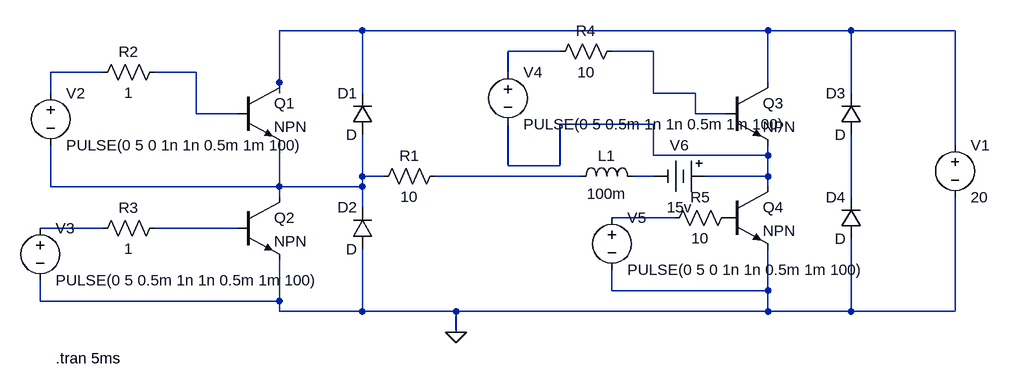
[diagram p0: schematic FullWaveInverter_RLE.asc]
FullWaveInverter_RLE.asc, the LTspice schematic file:
Version 4
SHEET 1 1180 680
WIRE 208 48 80 48
WIRE 832 48 208 48
WIRE 960 48 832 48
WIRE 1120 48 960 48
WIRE 512 80 432 80
WIRE 656 80 592 80
WIRE -192 112 -272 112
WIRE -48 112 -112 112
WIRE 432 112 432 80
WIRE 80 128 80 48
WIRE 832 128 832 48
WIRE -272 144 -272 112
WIRE 80 144 80 128
WIRE 208 144 208 48
WIRE 656 144 656 80
WIRE 720 144 656 144
WIRE 960 144 960 48
WIRE -48 176 -48 112
WIRE 16 176 -48 176
WIRE 720 176 720 144
WIRE 768 176 720 176
WIRE 656 192 512 192
WIRE 1120 224 1120 48
WIRE 656 240 656 192
WIRE 832 240 832 224
WIRE 832 240 656 240
WIRE 432 256 432 192
WIRE 512 256 512 192
WIRE 512 256 432 256
WIRE 208 272 208 208
WIRE 240 272 208 272
WIRE 544 272 320 272
WIRE 656 272 624 272
WIRE 832 272 832 240
WIRE 832 272 736 272
WIRE -272 288 -272 224
WIRE 80 288 80 224
WIRE 80 288 -272 288
WIRE 208 288 208 272
WIRE 208 288 80 288
WIRE 832 288 832 272
WIRE 80 304 80 288
WIRE 960 304 960 208
WIRE 208 320 208 288
WIRE 688 336 592 336
WIRE -192 352 -288 352
WIRE 16 352 -112 352
WIRE 592 448 592 416
WIRE 832 448 832 384
WIRE 832 448 592 448
WIRE -288 464 -288 432
WIRE 80 464 80 400
WIRE 80 464 -288 464
WIRE 80 480 80 464
WIRE 208 480 208 384
WIRE 208 480 80 480
WIRE 352 480 208 480
WIRE 832 480 832 448
WIRE 832 480 352 480
WIRE 960 480 960 368
WIRE 960 480 832 480
WIRE 1120 480 1120 304
WIRE 1120 480 960 480
WIRE 352 512 352 480
FLAG 352 512 0
SYMBOL diode 224 208 R180
WINDOW 0 24 64 Left 2
WINDOW 3 24 0 Left 2
SYMATTR InstName D1
SYMBOL diode 224 384 R180
WINDOW 0 24 64 Left 2
WINDOW 3 24 0 Left 2
SYMATTR InstName D2
SYMBOL diode 976 208 R180
WINDOW 0 24 64 Left 2
WINDOW 3 24 0 Left 2
SYMATTR InstName D3
SYMBOL diode 976 368 R180
WINDOW 0 24 64 Left 2
WINDOW 3 24 0 Left 2
SYMATTR InstName D4
SYMBOL npn 16 128 R0
SYMATTR InstName Q1
SYMBOL npn 16 304 R0
SYMATTR InstName Q2
SYMBOL npn 768 128 R0
SYMATTR InstName Q3
SYMBOL npn 768 288 R0
SYMATTR InstName Q4
SYMBOL res 336 256 R90
WINDOW 0 0 56 VBottom 2
WINDOW 3 32 56 VTop 2
SYMATTR InstName R1
SYMATTR Value 10
SYMBOL voltage 1120 208 R0
SYMATTR InstName V1
SYMATTR Value 20
SYMBOL voltage -272 128 R0
SYMATTR InstName V2
SYMATTR Value PULSE(0 5 0 1n 1n 0.5m 1m 100)
SYMBOL voltage -288 336 R0
SYMATTR InstName V3
SYMATTR Value PULSE(0 5 0.5m 1n 1n 0.5m 1m 100)
SYMBOL res -96 96 R90
WINDOW 0 0 56 VBottom 2
WINDOW 3 32 56 VTop 2
SYMATTR InstName R2
SYMATTR Value 1
SYMBOL res -208 368 R270
WINDOW 0 32 56 VTop 2
WINDOW 3 0 56 VBottom 2
SYMATTR InstName R3
SYMATTR Value 1
SYMBOL voltage 432 96 R0
SYMATTR InstName V4
SYMATTR Value PULSE(0 5 0.5m 1n 1n 0.5m 1m 100)
SYMBOL res 608 64 R90
WINDOW 0 0 56 VBottom 2
WINDOW 3 32 56 VTop 2
SYMATTR InstName R4
SYMATTR Value 10
SYMBOL voltage 592 320 R0
SYMATTR InstName V5
SYMATTR Value PULSE(0 5 0 1n 1n 0.5m 1m 100)
SYMBOL res 672 352 R270
WINDOW 0 32 56 VTop 2
WINDOW 3 0 56 VBottom 2
SYMATTR InstName R5
SYMATTR Value 10
SYMBOL ind 528 288 R270
WINDOW 0 32 56 VTop 2
WINDOW 3 5 56 VBottom 2
SYMATTR InstName L1
SYMATTR Value 100m
SYMBOL Misc/battery 752 272 R90
WINDOW 0 -32 56 VBottom 2
WINDOW 3 32 56 VTop 2
SYMATTR InstName V6
SYMATTR Value 15v
TEXT -264 552 Left 2 !.tran 5ms

The netlist it stands for:
* FullWaveInverter_RLE.asc
D1 N007 N001 D
D2 0 N007 D
D3 N010 N001 D
D4 0 N010 D
Q1 N001 N005 N007 0 NPN
Q2 N007 N013 0 0 NPN
Q3 N001 N003 N006 0 NPN
Q4 N006 P001 0 0 NPN
R1 N008 N007 10
V1 N001 0 20
V2 N004 N007 PULSE(0 5 0 1n 1n 0.5m 1m 100)
V3 N012 0 PULSE(0 5 0.5m 1n 1n 0.5m 1m 100)
R2 N005 N004 1
R3 N012 N013 1
V4 N002 N006 PULSE(0 5 0.5m 1n 1n 0.5m 1m 100)
R4 N003 N002 10
V5 N011 0 PULSE(0 5 0 1n 1n 0.5m 1m 100)
R5 N011 P001 10
L1 N008 N009 100m
V6 N006 N009 15v
.model D D
.lib standard.dio
.model NPN NPN
.model PNP PNP
.lib standard.bjt
.tran 5ms
.backanno
.end